# EAGLE design booster (EAGLE 9.1.3)
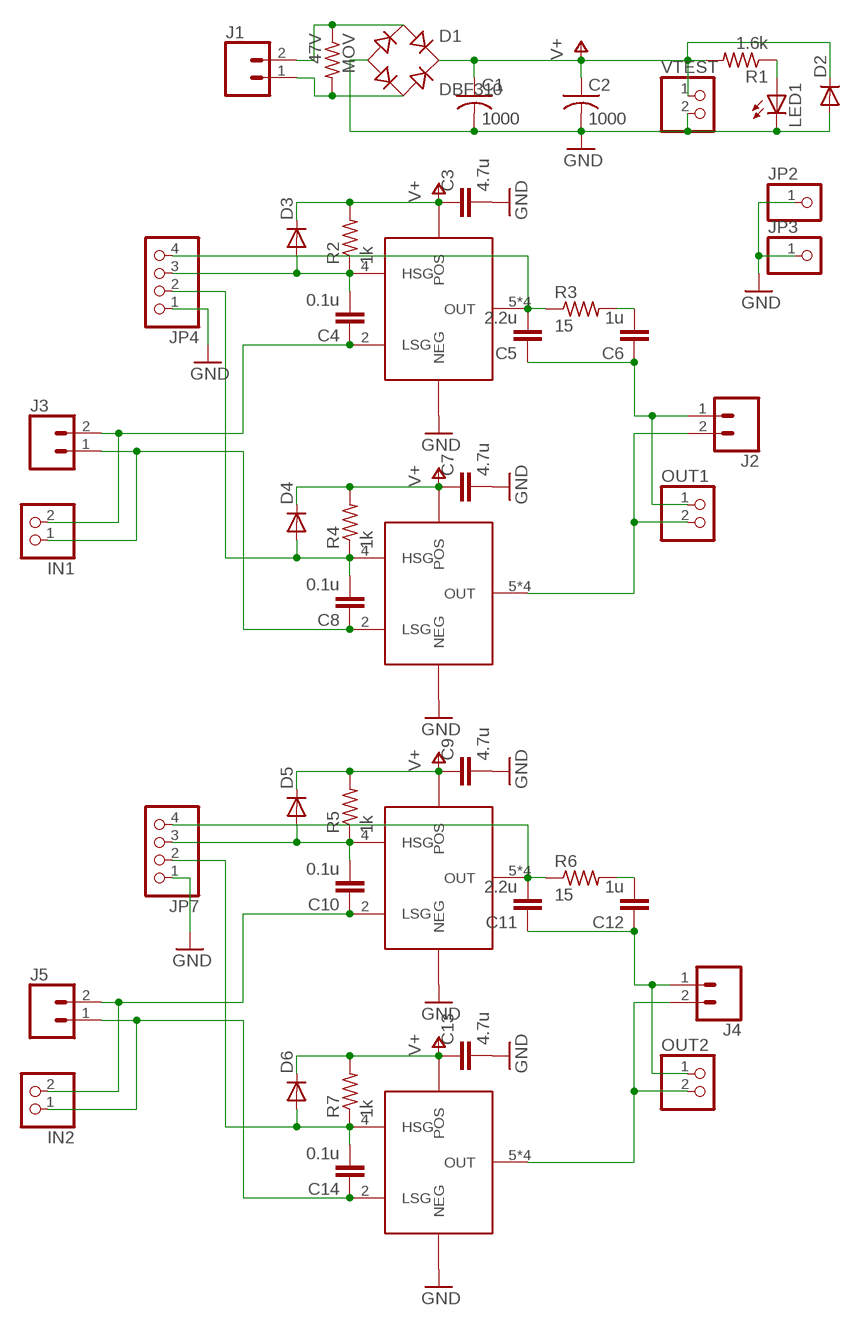
[diagram p0: schematic, sheet 1]

## Parts
C1  1000  UVY1H102MHD  [CAPPRD500W65D1250H2500B]
C2  1000  UVY1H102MHD  [CAPPRD500W65D1250H2500B]
C3  4.7u  C-EUC1206  [C1206]
C4  0.1u  C-EUC1206  [C1206]
C5  2.2u  C-EUC1206  [C1206]
C6  1u  C-EUC1206  [C1206]
C7  4.7u  C-EUC1206  [C1206]
C8  0.1u  C-EUC1206  [C1206]
C9  4.7u  C-EUC1206  [C1206]
C10  0.1u  C-EUC1206  [C1206]
C11  2.2u  C-EUC1206  [C1206]
C12  1u  C-EUC1206  [C1206]
C13  4.7u  C-EUC1206  [C1206]
C14  0.1u  C-EUC1206  [C1206]
D1  DBF310  [4-SMD]
D2  DIODE-SMB  [SMB]
D3  DIODE-SMB  [SMB]
D4  DIODE-SMB  [SMB]
D5  DIODE-SMB  [SMB]
D6  DIODE-SMB  [SMB]
IN1  PINHD-1X2  [1X02]
IN2  PINHD-1X2  [1X02]
J1  CONN_025MM  [SCREWTERMINAL-5MM-2]
J2  CONN_025MM  [SCREWTERMINAL-5MM-2]
J3  CONN_025MM  [SCREWTERMINAL-5MM-2]
J4  CONN_025MM  [SCREWTERMINAL-5MM-2]
J5  CONN_025MM  [SCREWTERMINAL-5MM-2]
JP2  PINHD-1X1  [1X01]
JP3  PINHD-1X1  [1X01]
JP4  PINHD-1X4  [1X04]
JP7  PINHD-1X4  [1X04]
LED1  LED5MM  [LED5MM]
MOV  47V  R-US_R1206  [R1206]
OUT1  PINHD-1X2  [1X02]
OUT2  PINHD-1X2  [1X02]
R1  1.6k  R-US_R2512  [R2512]
R2  1k  R-US_R1206  [R1206]
R3  15  R-US_R1206  [R1206]
R4  1k  R-US_R1206  [R1206]
R5  1k  R-US_R1206  [R1206]
R6  15  R-US_R1206  [R1206]
R7  1k  R-US_R1206  [R1206]
U1  SI4554DY  [SOIC-8]
U2  SI4554DY  [SOIC-8]
U3  SI4554DY  [SOIC-8]
U4  SI4554DY  [SOIC-8]
VTEST  PINHD-1X2  [1X02]

## Nets
GND: C1.2 C2.2 C3.2 C7.2 C9.2 C13.2 D1.- D2.A JP2.1 JP3.1 JP4.1 JP7.1 LED1.K(C) U1.1(NEG) U2.1(NEG) U3.1(NEG) U4.1(NEG) VTEST.2
N$2: LED1.A R1.1
N$3: C5.2 JP4.4 R3.1 U1.5(OUT) U1.6(OUT) U1.7(OUT) U1.8(OUT)
N$4: D1.~1(AC1) J1.2 MOV.1
N$5: C6.2 R3.2
N$6: C5.1 C6.1 J2.1 OUT1.1
N$7: J2.2 OUT1.2 U2.5(OUT) U2.6(OUT) U2.7(OUT) U2.8(OUT)
N$8: C4.1 IN1.2 J3.2 U1.2(LSG)
N$9: C4.2 D3.A JP4.3 R2.1 U1.4(HSG)
N$10: C11.2 JP7.4 R6.1 U3.5(OUT) U3.6(OUT) U3.7(OUT) U3.8(OUT)
N$11: C12.2 R6.2
N$12: C8.1 IN1.1 J3.1 U2.2(LSG)
N$13: C8.2 D4.A JP4.2 R4.1 U2.4(HSG)
N$14: C11.1 C12.1 J4.1 OUT2.1
N$15: C10.1 IN2.2 J5.2 U3.2(LSG)
N$16: C10.2 D5.A JP7.3 R5.1 U3.4(HSG)
N$17: C14.1 IN2.1 J5.1 U4.2(LSG)
N$18: C14.2 D6.A JP7.2 R7.1 U4.4(HSG)
N$19: J4.2 OUT2.2 U4.5(OUT) U4.6(OUT) U4.7(OUT) U4.8(OUT)
N$20: D1.~2(AC2) J1.1 MOV.2
V+: C1.1 C2.1 C3.1 C7.1 C9.1 C13.1 D1.+ D2.C D3.C D4.C D5.C D6.C R1.2 R2.2 R4.2 R5.2 R7.2 U1.3(POS) U2.3(POS) U3.3(POS) U4.3(POS) VTEST.1

## Library data of the parts
C1 C2 = drsstc:UVY1H102MHD
C3-C14 = resistor:C-EU: CAPACITOR, European symbol
D1 = drsstc:DBF310
D2-D6 = diode:DIODE-: DIODE
IN1 IN2 OUT1 OUT2 VTEST = pinhead:PINHD-1X2: PIN HEADER
J1-J5 = SparkFun-Connectors:CONN_02: Multi connection point. Often used as Generic Header-pin footprint for 0.1 inch spaced/style header connections On any of the 0.1 inch spaced packages, you can populate with these: Break Away Headers - Straight <https://www.sparkfun.com/products/116> (PRT-00116) Break Away Male Headers - Right Angle <https://www.sparkfun.com/products/553> (PRT-00553) Female Headers <https://www.sparkfun.com/products/115> (PRT-00115) Break Away Headers - Machine Pin <https://www.sparkfun.com/products/117> (PRT-00117) Break Away Female Headers - Swiss Machine Pin <https://www.sparkfun.com/products/743> (PRT-00743) For SCREWTERMINALS and SPRING TERMINALS visit here: Screw Terimnals on SparkFun.com <https://www.sparkfun.com/search/results?term=Screw+Terminals> (5mm/3.5mm/2.54mm spacing) This device is also useful as a general connection point to wire up your design to another part of your project. Our various solder wires solder well into these plated through hole pads. Hook-Up Wire - Assortment (Stranded, 22 AWG) <https://www.sparkfun.com/products/11375> (PRT-11375) Hook-Up Wire - Assortment (Solid Core, 22 AWG) <https://www.sparkfun.com/products/11367> (PRT-11367) View the entire wire category on our website here <https://www.sparkfun.com/categories/141> Special notes: Molex polarized connector foot print use with: PRT-08233 with associated crimp pins and housings. 2.54_SCREWTERM for use with PRT-10571. 3.5mm Screw Terminal footprints for PRT-08084 5mm Screw Terminal footprints for use with PRT-08432; SF_SKU: PRT-08432
JP2 JP3 = pinhead:PINHD-1X1: PIN HEADER
JP4 JP7 = pinhead:PINHD-1X4: PIN HEADER
LED1 = led:LED: LED OSRAM: - CHIPLED LG R971, LG N971, LY N971, LG Q971, LY Q971, LO R971, LY R971 LH N974, LH R974 LS Q976, LO Q976, LY Q976 LO Q996 - Hyper CHIPLED LW Q18S LB Q993, LB Q99A, LB R99A - SideLED LS A670, LO A670, LY A670, LG A670, LP A670 LB A673, LV A673, LT A673, LW A673 LH A674 LY A675 LS A676, LA A676, LO A676, LY A676, LW A676 LS A679, LY A679, LG A679 - Hyper Micro SIDELED® LS Y876, LA Y876, LO Y876, LY Y876 LT Y87S - SmartLED LW L88C, LW L88S LB L89C, LB L89S, LG L890 LS L89K, LO L89K, LY L89K LS L896, LA L896, LO L896, LY L896 - TOPLED LS T670, LO T670, LY T670, LG T670, LP T670 LSG T670, LSP T670, LSY T670, LOP T670, LYG T670 LG T671, LOG T671, LSG T671 LB T673, LV T673, LT T673, LW T673 LH T674 LS T676, LA T676, LO T676, LY T676, LB T676, LH T676, LSB T676, LW T676 LB T67C, LV T67C, LT T67C, LS T67K, LO T67K, LY T67K, LW E67C LS E67B, LA E67B, LO E67B, LY E67B, LB E67C, LV E67C, LT E67C LW T67C LS T679, LY T679, LG T679 LS T770, LO T770, LY T770, LG T770, LP T770 LB T773, LV T773, LT T773, LW T773 LH T774 LS E675, LA E675, LY E675, LS T675 LS T776, LA T776, LO T776, LY T776, LB T776 LHGB T686 LT T68C, LB T68C - Hyper Mini TOPLED® LB M676 - Mini TOPLED Santana® LG M470 LS M47K, LO M47K, LY M47K Source: http://www.osram.convergy.de LUXEON: - LUMILED® LXK2-PW12-R00, LXK2-PW12-S00, LXK2-PW14-U00, LXK2-PW14-V00 LXK2-PM12-R00, LXK2-PM12-S00, LXK2-PM14-U00 LXK2-PE12-Q00, LXK2-PE12-R00, LXK2-PE12-S00, LXK2-PE14-T00, LXK2-PE14-U00 LXK2-PB12-K00, LXK2-PB12-L00, LXK2-PB12-M00, LXK2-PB14-N00, LXK2-PB14-P00, LXK2-PB14-Q00 LXK2-PR12-L00, LXK2-PR12-M00, LXK2-PR14-Q00, LXK2-PR14-R00 LXK2-PD12-Q00, LXK2-PD12-R00, LXK2-PD12-S00 LXK2-PH12-R00, LXK2-PH12-S00 LXK2-PL12-P00, LXK2-PL12-Q00, LXK2-PL12-R00 Source: www.luxeon.com KINGBRIGHT: KA-3528ASYC Source: www.kingbright.com
MOV R1-R7 = resistor:R-US_: RESISTOR, American symbol
U1-U4 = drsstc:SI4554DY

## Board
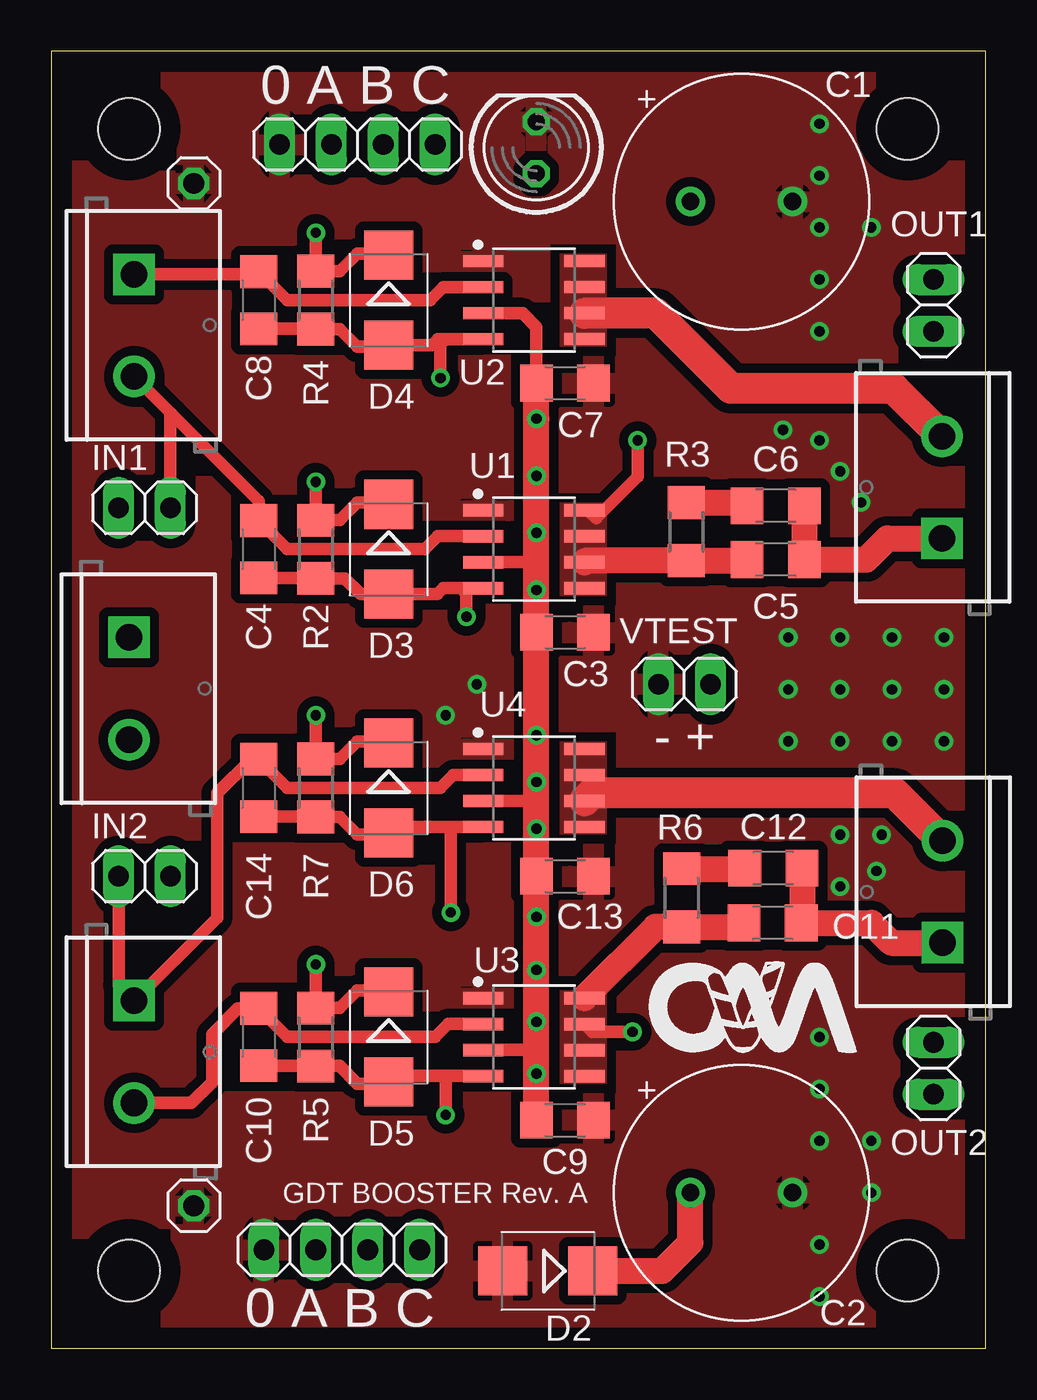
[diagram p1: board, top side]
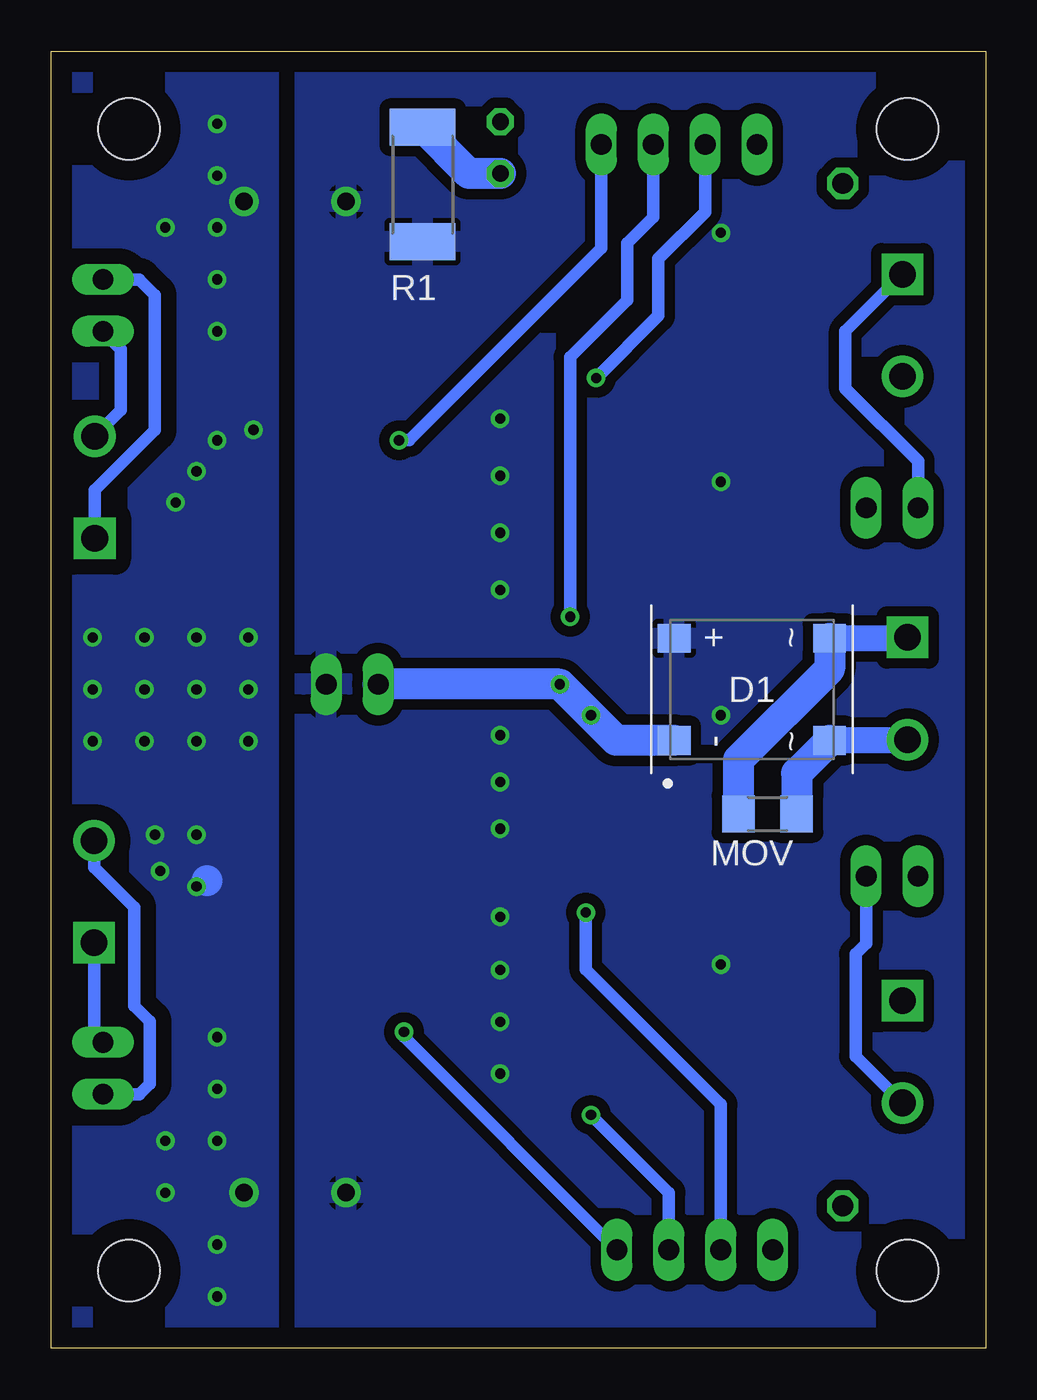
[diagram p2: board, bottom side, seen from below]

Size 45.72 x 63.5 mm. Coordinates in mm from the lower left corner, seen from the top.
Outline: 0,0 45.72,0 45.72,63.5 0,63.5 0,0
Copper layers (1*16): Top 0.035mm / dielectric 1.5mm / Bottom 0.035mm
Design rules "default *": minimum track width 6mil, minimum drill 0.35mm, track to track 6mil, track to pad 6mil, pad to pad 6mil, via to via 6mil, smd to smd 6mil, copper to edge 40mil, drill to drill 6mil, minimum pad ring 10mil, minimum via ring 8mil, stop-mask expansion 4mil, vias tented up to drill 20mil, thermal gap 10mil
Holes 3 mm at 3.81,3.81 41.91,3.81 41.91,59.69 3.81,59.69

### Footprints (pad centres in the part's own frame; a part is rotated, then mirrored left to right if it is on the bottom)
CAPPRD500W65D1250H2500B = drill 0.85 pad 1.45: 1 -2.5,0; 2 2.5,0
C1206 = smd 1.6 x 1.8: 1 -1.4,0; 2 1.4,0
4-SMD = smd 1.4 x 1.6: + 2.5,3.8; - -2.5,3.8; ~1 -2.5,-3.8; ~2 2.5,-3.8
SMB = smd 2.4 x 2.4: A 2.2,0; C -2.2,0
1X02 = drill 1.016 long: 1 -1.27,0; 2 1.27,0
SCREWTERMINAL-5MM-2 = drill 1.3 pad 2.032 square: 1 0,0 | drill 1.3 pad 2.032: 2 5,0
1X01 = drill 1.016 octagon: 1 0,0
1X04 = drill 1.016 long: 1 -3.81,0; 2 -1.27,0; 3 1.27,0; 4 3.81,0
LED5MM = drill 0.813 octagon: A -1.27,0; K 1.27,0
R1206 = smd 1.6 x 1.803: 1 -1.422,0; 2 1.422,0
R2512 = smd 1.8 x 3.2: 1 -2.8,0; 2 2.8,0
SOIC-8 = smd 1.968 x 0.602: 1 -2.473,1.905; 2 -2.473,0.635; 3 -2.473,-0.635; 4 -2.473,-1.905; 5 2.473,-1.905; 6 2.473,-0.635; 7 2.473,0.635; 8 2.473,1.905

### Placement (x,y rotation side)
C1  33.78,56.13 0 top
C2  33.78,7.62 0 top
C3  25.15,35.05 0 top
C4  10.16,39.12 270 top
C5  35.46,38.61 180 top
C6  35.46,41.25 180 top
C7  25.15,47.24 0 top
C8  10.16,51.31 270 top
C9  25.15,11.18 0 top
C10  10.16,15.24 270 top
C11  35.31,20.83 180 top
C12  35.34,23.51 180 top
C13  25.15,23.11 0 top
C14  10.16,27.43 270 top
D1  11.43,32.26 90 bottom
D2  24.31,3.79 180 top
D3  16.51,39.12 270 top
D4  16.51,51.31 270 top
D5  16.51,15.24 270 top
D6  16.51,27.43 270 top
IN1  4.57,41.15 0 top
IN2  4.57,23.11 0 top
J1  3.81,34.8 270 top
J2  43.58,39.65 90 top
J3  4.06,52.58 270 top
J4  43.62,19.85 90 top
J5  4.06,17.02 270 top
JP2  6.99,6.99 0 top
JP3  6.99,57.02 0 top
JP4  14.99,58.93 0 top
JP7  14.22,4.83 0 top
LED1  23.74,58.77 90 top
MOV  10.67,26.16 180 bottom
OUT1  43.18,51.05 270 top
OUT2  43.18,13.72 270 top
R1  27.54,56.97 270 bottom
R2  12.95,39.12 90 top
R3  31.07,39.98 90 top
R4  12.95,51.31 90 top
R5  12.95,15.24 90 top
R6  30.85,22.06 90 top
R7  12.95,27.43 90 top
U1  23.62,39.12 0 top
U2  23.62,51.31 0 top
U3  23.62,15.24 0 top
U4  23.62,27.43 0 top
VTEST  30.99,32.51 180 top

### Tracks (layer width: path | path; a pad name or v marks a point on that pad's centre or on a via)
GND  (via drill 0.5)
  Bottom 1.524: D1.- 18.07,29.76 v20.83,32.51 VTEST.2 | 38.1,22.9
  other vias: 37.59,54.86 40.13,54.86 37.59,52.32 37.59,49.78 38.61,42.93 35.81,44.96 37.59,44.45 39.62,41.4 41.15,34.8 43.69,34.8 43.69,32.26 41.15,32.26 41.15,29.72 43.69,29.72 37.59,15.24 37.59,12.7 37.59,10.16 40.13,10.16 38.61,25.15 40.39,23.37 38.61,22.61 40.64,25.15 38.61,34.8 38.61,32.26 38.61,29.72 37.59,57.4 37.59,59.94 40.13,7.62 37.59,5.08 37.59,2.54 36.07,34.8 36.07,32.26 36.07,29.72 19.3,30.99
  pour Top (isolate 0.457, rank 2): 0,0 45.72,0 45.72,63.5 0,63.5
  pour Bottom (isolate 0.762, rank 2, no thermals): 34.04,63.5 45.72,63.5 45.72,0 34.04,0
N$2
  Bottom 1.524: LED1.A 25.27,57.5 R1.1
N$3  (via drill 0.5)
  Top 0.61: v28.7,44.45 28.7,42.67 26.67,40.64 26.29,41.02 U1.8
  Top 1.27: C5.2 34,38.56 R3.1 26.17,38.56 U1.6
  Bottom 0.61: JP4.4 18.8,53.85 28.19,44.45 v28.7,44.45
  pour Top (no thermals): 25.15,41.4 27.18,41.4 27.18,36.83 24.89,36.83 24.89,41.4
N$4
  Bottom 1.27: J1.2 3.85,29.76 D1.~1
  Bottom 1.524: D1.~1 9.25,28.14 MOV.1
N$5
  Top 1.27: R3.2 33.9,41.4 C6.2
N$6
  Top 1.27: C6.1 C5.1 39.88,38.61 40.92,39.65 J2.1
  Bottom 0.61: OUT1.1 41.4,52.32 40.64,51.56 40.64,44.96 43.58,42.01 J2.1
N$7
  Top 1.524: J2.2 41.24,46.99 33.27,46.99 29.59,50.67 U2.6
  Bottom 0.61: OUT1.2 42.31,48.92 42.31,45.92 J2.2
  pour Top (no thermals): 25.15,53.59 27.18,53.59 27.18,49.02 24.89,49.02 24.89,53.59
N$8
  Top 0.61: U1.2 18.92,39.75 18.29,39.12 11.56,39.12 C4.1 10.16,41.48 5.88,45.76 | J3.2 5.88,45.76 | IN1.2 5.84,45.72 5.88,45.76
N$9  (via drill 0.5)
  Top 0.61: C4.2 12.93,37.72 R2.1 14.38,37.69 15.15,36.92 D3.A 18.88,36.92 19.18,37.21 20.07,37.21 | 20.07,37.21 U1.4 | v20.32,35.81 20.32,36.96 20.07,37.21
  Bottom 0.61: JP4.3 16.26,55.37 17.53,54.1 17.53,51.31 20.32,48.51 v20.32,35.81
N$10  (via drill 0.5)
  Top 0.61: v28.45,15.49 26.48,15.49 U3.7
  Top 1.27: U3.8 29.58,20.63 R6.1 33.71,20.63 C11.2
  Bottom 0.61: JP7.4 28.45,15.24 v28.45,15.49
  pour Top (no thermals): 24.89,17.53 27.18,17.53 27.18,12.95 24.89,12.95
N$11
  Top 1.27: R6.2 33.92,23.48 C12.2
N$12
  Top 0.61: J3.1 10.03,52.58 C8.1 11.56,51.31 18.54,51.31 19.18,51.94 U2.2
  Bottom 0.61: IN1.1 3.3,43.43 6.86,46.99 6.86,49.78 J3.1
N$13  (via drill 0.5)
  Top 0.61: C8.2 12.93,49.91 R4.1 14.12,49.89 14.99,49.02 16.42,49.02 D4.A 18.63,49.11 18.92,49.4 19.3,49.4 | 19.3,49.4 U2.4 | v19.05,47.5 19.05,49.15 19.3,49.4
  Bottom 0.61: JP4.2 13.72,55.63 16,53.34 16,50.55 v19.05,47.5
N$14
  Top 1.27: C12.1 36.74,20.87 C11.1 40.13,20.83 41.11,19.85 J4.1
  Bottom 0.61: OUT2.1 43.62,15.42 J4.1
N$15
  Top 0.61: U3.2 19.43,15.88 18.8,15.24 11.56,15.24 C10.1 9.14,16.64 7.87,15.37 7.87,13.03 6.86,12.02 J5.2
  Bottom 0.61: IN2.2 5.84,19.81 6.35,19.3 6.35,14.3 J5.2
N$16  (via drill 0.5)
  Top 0.61: C10.2 12.93,13.84 R5.1 14.12,13.82 14.99,12.95 16.42,12.95 D5.A 16.8,13.34 19.3,13.34 | 19.3,13.34 U3.4 | v19.3,11.43 19.3,13.34
  Bottom 0.61: JP7.3 15.49,7.62 v19.3,11.43
N$17
  Top 0.61: U4.2 19.68,28.07 19.05,27.43 11.56,27.43 C14.1 9.78,28.83 8.13,27.18 8.13,21.08 J5.1 3.3,17.78 IN2.1
N$18  (via drill 0.5)
  Top 0.61: 19.56,25.53 16.8,25.53 D6.A 16.42,25.15 14.99,25.15 14.12,26.01 R7.1 12.93,26.03 C14.2 | 19.56,25.53 U4.4 | v19.56,21.34 19.56,25.53
  Bottom 0.61: JP7.2 12.95,11.94 19.56,18.54 v19.56,21.34
N$19
  Top 1.524: J4.2 41.29,27.18 26.48,27.18 U4.6
  Bottom 0.61: OUT2.2 41.4,12.45 40.89,12.95 40.89,16 41.66,16.76 41.66,21.59 43.62,23.55 J4.2
  pour Top (no thermals): 24.89,29.72 27.18,29.72 27.18,25.15 24.89,25.15
N$20
  Bottom 1.27: J1.1 3.85,34.76 D1.~2
  Bottom 1.524: D1.~2 7.63,33.26 12.09,28.8 MOV.2
V+  (via drill 0.5)
  Top 0.61: D4.C 16.42,53.59 14.99,53.59 14.12,52.73 R4.2 v12.95,54.61 | D3.C 16.42,41.4 14.99,41.4 14.12,40.54 R2.2 v12.95,42.42 | D6.C 16.42,29.72 14.99,29.72 14.12,28.85 R7.2 v12.95,30.99 | D5.C 16.42,17.53 14.99,17.53 14.12,16.66 R5.2 v12.95,18.8 | C7.1 23.75,50 23.07,50.67 U2.3 | U3.3 23.75,14.61 v23.75,13.45 | U4.3 23.75,26.8 v23.75,27.73 | U1.3 23.5,38.48 23.75,38.23 v23.75,37.12
  Top 1.27: D2.C 29.9,3.79 31.28,5.17 C2.1 | C9.1 C13.1 C3.1 C7.1 v23.75,45.51
  other vias: 23.75,18.53 23.75,21.12 23.75,15.99 23.75,25.44 23.75,30.01 23.75,39.92 23.75,42.71
  pour Bottom (isolate 0.508): 0,0 33.27,0 33.27,63.5 0,63.5

### Text on the board
tPlace: 0 A B C | - + | GDT BOOSTER Rev. A | 0 A B C